# EAGLE design fanatone-adc (EAGLE 7.5.0)
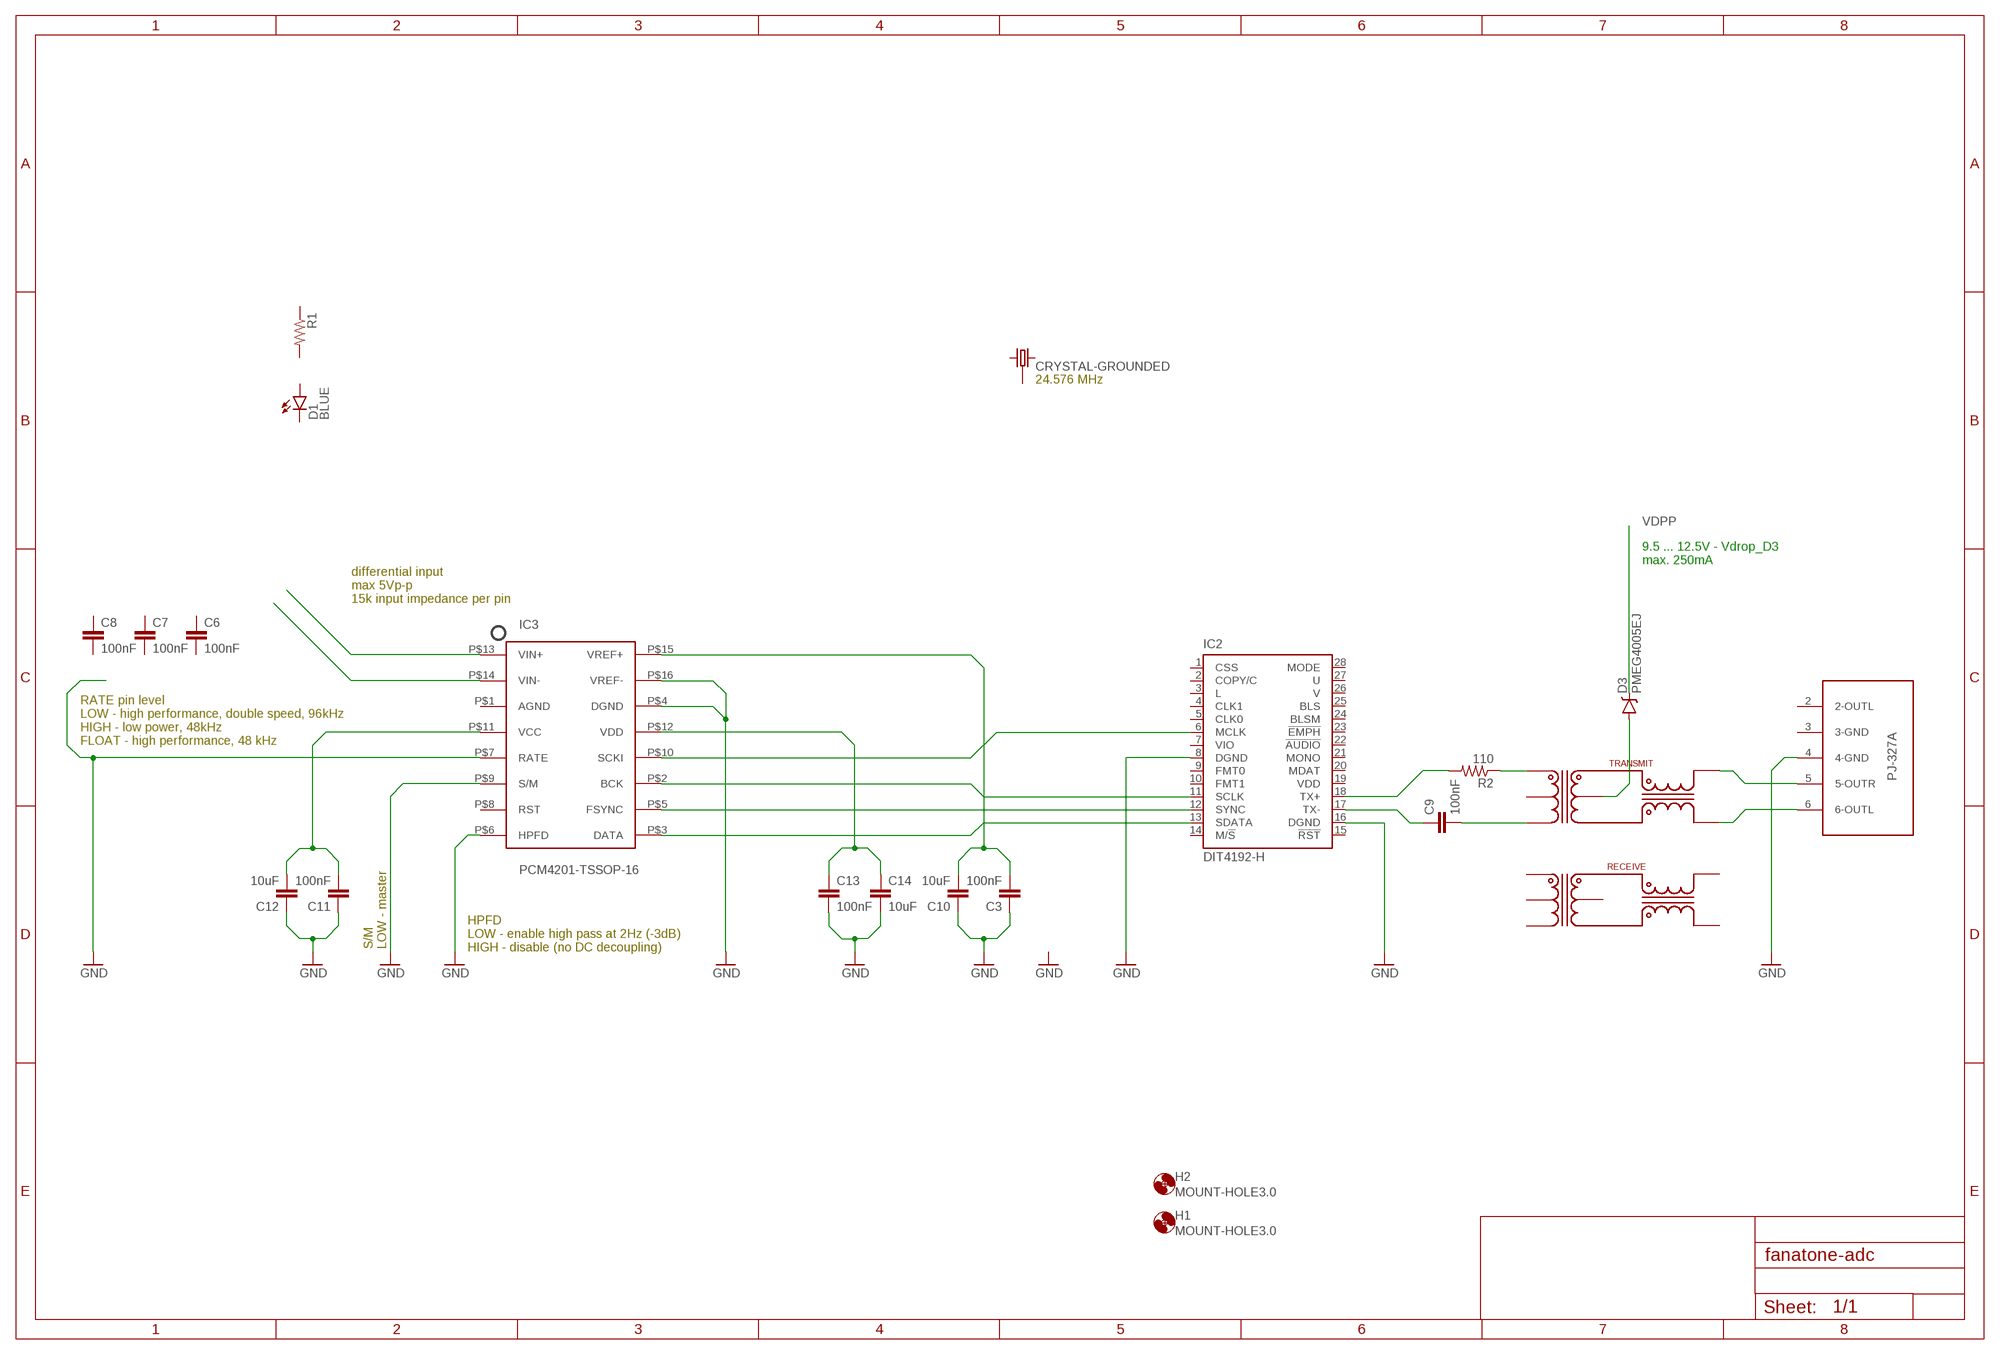
[diagram p0: schematic, sheet 1, part 1 of 3]
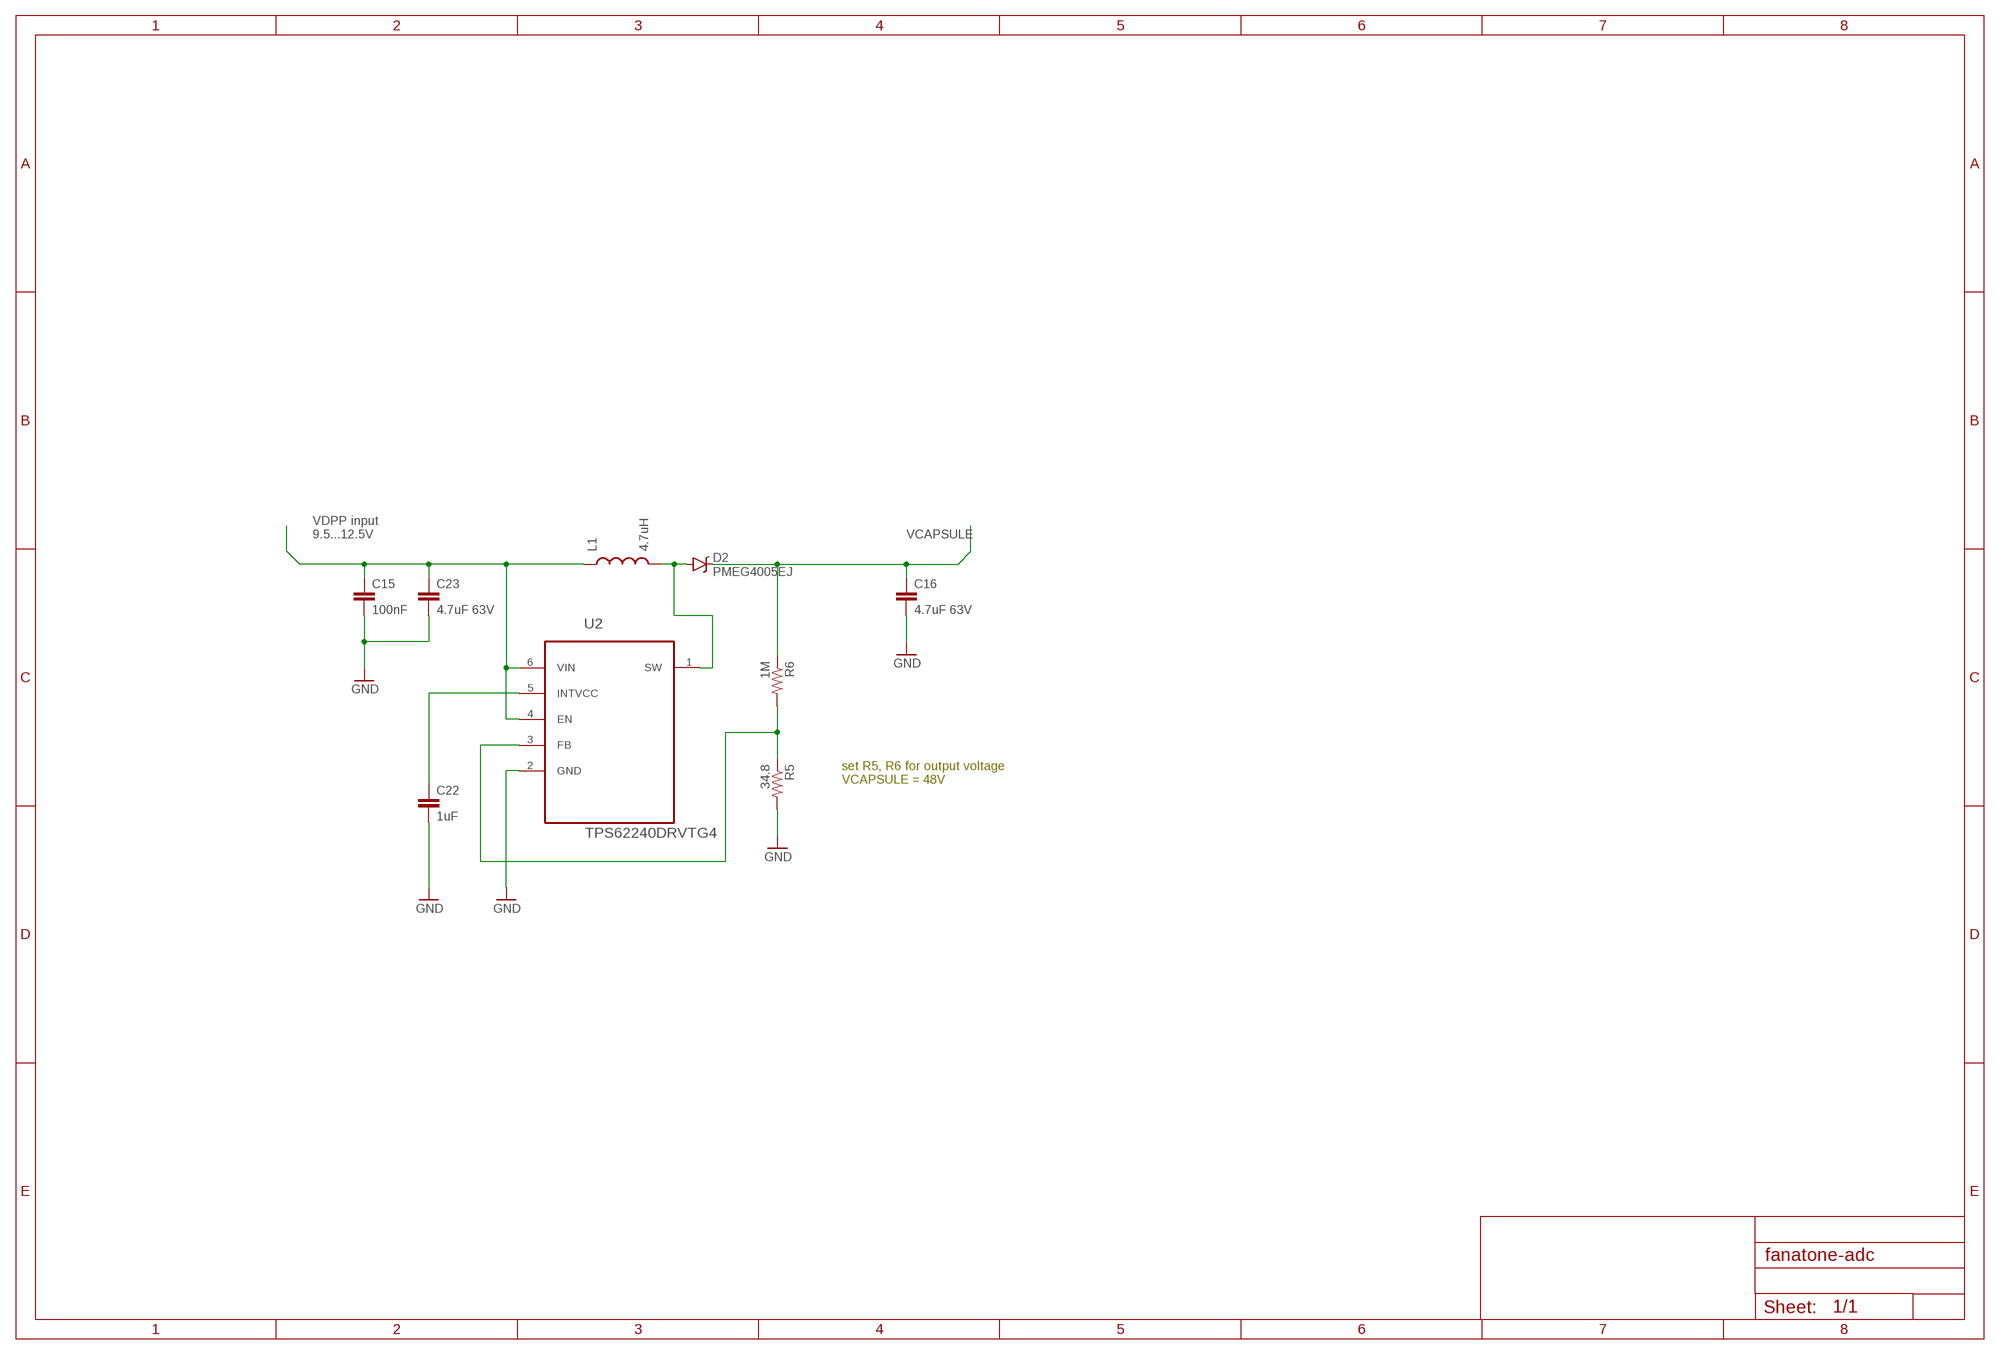
[diagram p1: schematic, sheet 1, part 2 of 3]
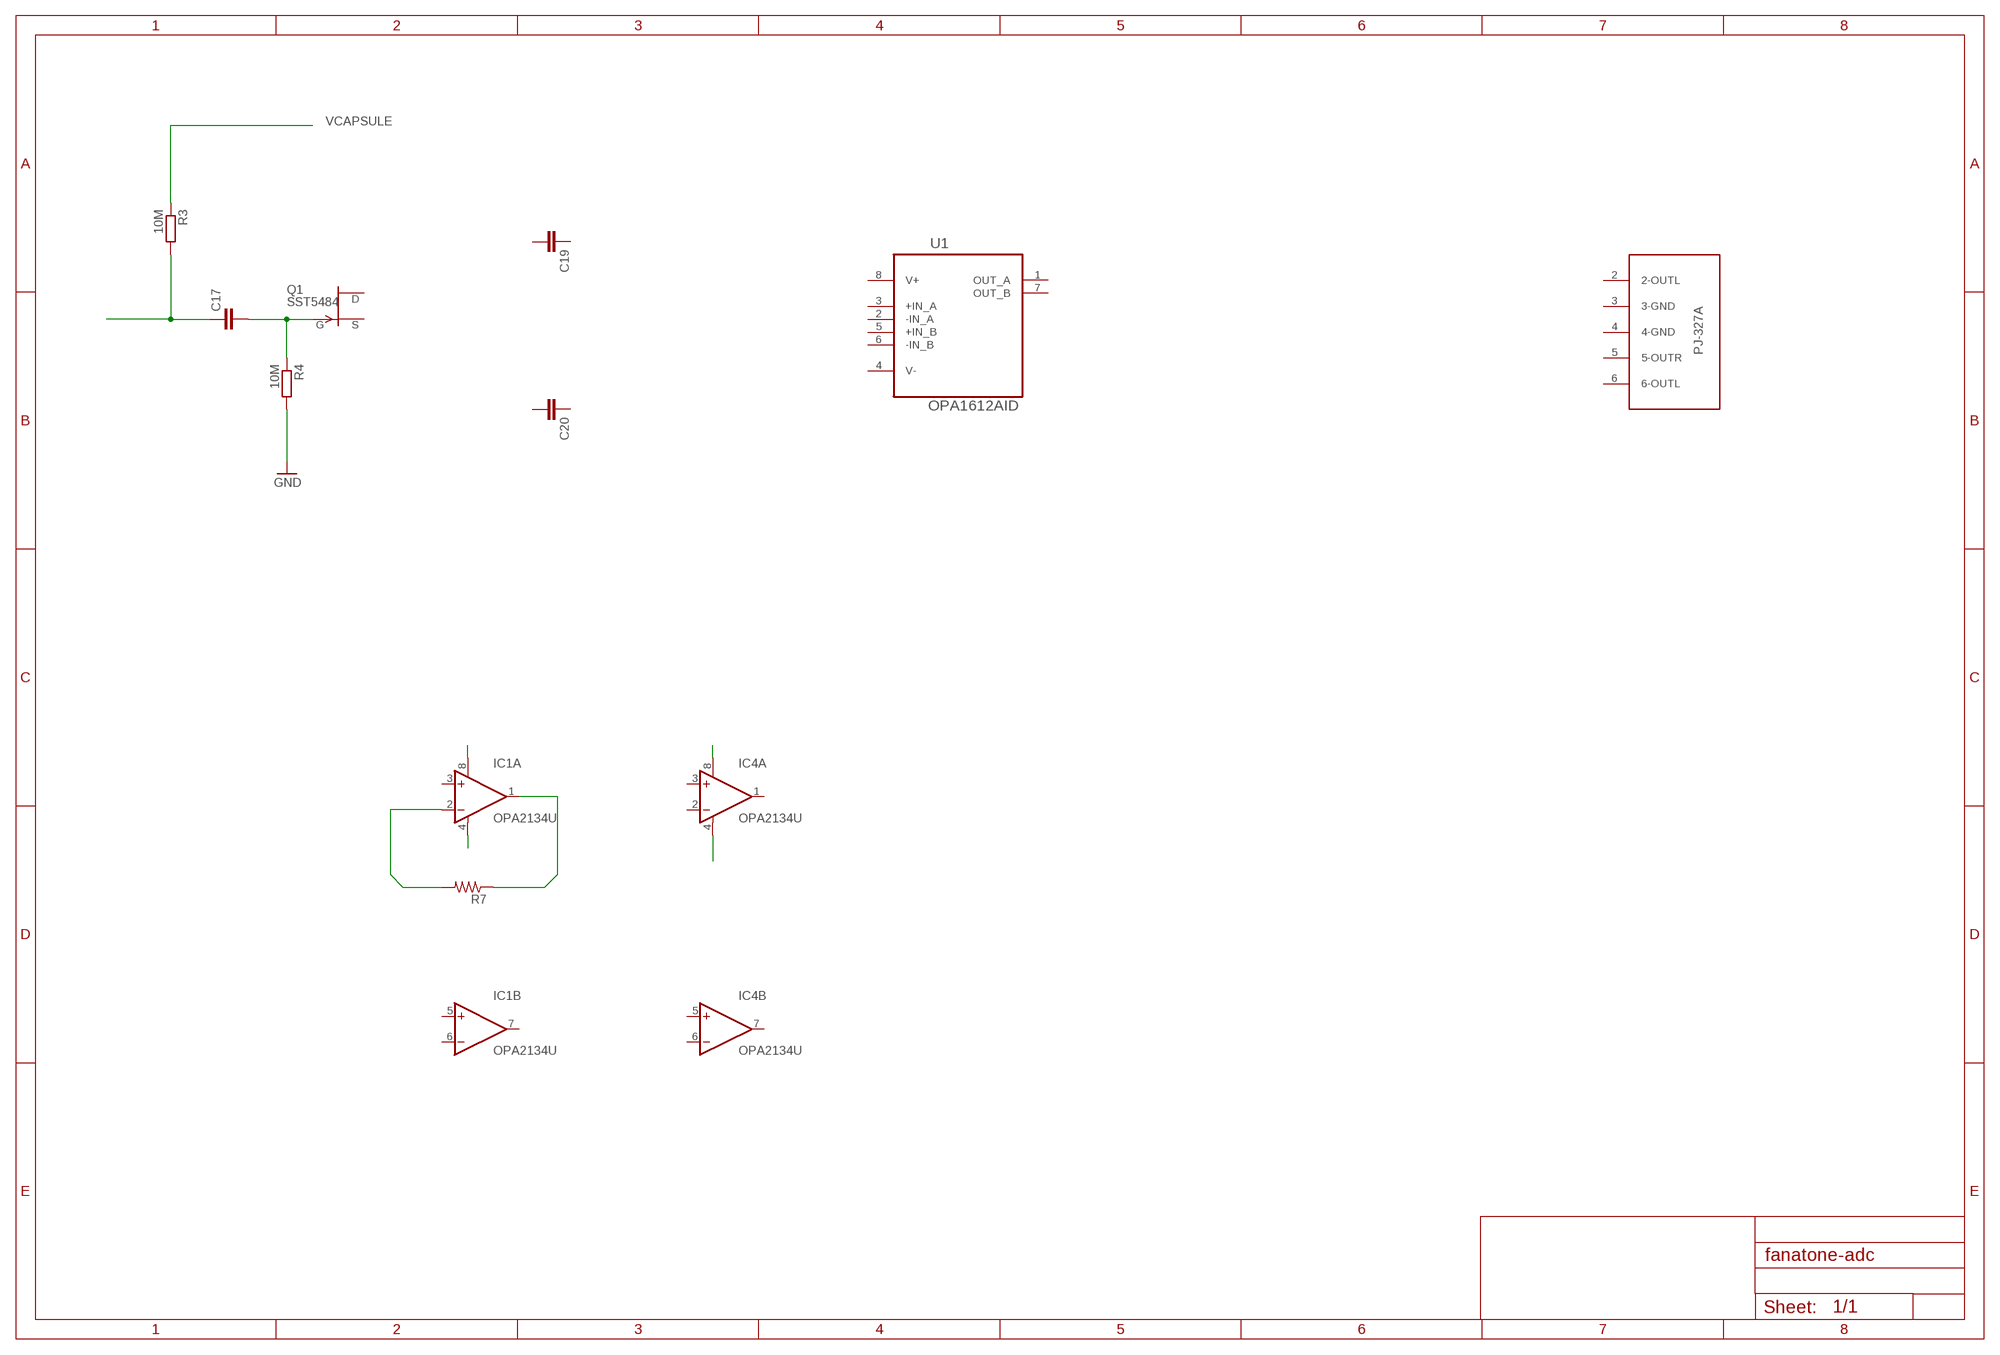
[diagram p2: schematic, sheet 1, part 3 of 3]

## Parts
C3  100nF  CAP0402-CAP  [0402-CAP]
C6  100nF  CAP0402-CAP  [0402-CAP]
C7  100nF  CAP0402-CAP  [0402-CAP]
C8  100nF  CAP0402-CAP  [0402-CAP]
C9  100nF  CAP0402-CAP  [0402-CAP]
C10  10uF  CAP0805  [0805]
C11  100nF  CAP0402-CAP  [0402-CAP]
C12  10uF  CAP0805  [0805]
C13  100nF  CAP0402-CAP  [0402-CAP]
C14  10uF  CAP0805  [0805]
C15  100nF  CAP0402-CAP  [0402-CAP]
C16  4.7uF 63V  CAP0805  [0805]
C17  C-EUC0603K  [C0603K]
C19  C-EUC0603K  [C0603K]
C20  C-EUC0603K  [C0603K]
C22  1uF  CAP0805  [0805]
C23  4.7uF 63V  CAP0805  [0805]
D1  BLUE  LED-BLUE0603  [LED-0603]
D2  PMEG4005EJ  DIODE-SCHOTTKY-PMEG4005EJ  [SOD-323]
D3  PMEG4005EJ  DIODE-SCHOTTKY-PMEG4005EJ  [SOD-323]
H1  MOUNT-HOLE3.0  [3,0]
H2  MOUNT-HOLE3.0  [3,0]
IC1  OPA2134U  [SO08]
IC2  DIT4192-H  [PW_R-PDSO-G28]
IC3  PCM4201-TSSOP-16  [TSSOP-16]
IC4  OPA2134U  [SO08]
L1  4.7uH  INDUCTOR0805  [0805]
Q1  SST5484  [SOT23]
R1  RESISTOR0603-RES  [0603-RES]
R2  110  RESISTOR0603-RES  [0603-RES]
R3  10M  R-EU_R0805W  [R0805W]
R4  10M  R-EU_R0805W  [R0805W]
R5  34.8  RESISTOR0603-RES  [0603-RES]
R6  1M  RESISTOR0603-RES  [0603-RES]
R7  RESISTOR0603-RES  [0603-RES]
U1  OPA1612AID  [SOIC127P600X175-8N]
U2  TPS62240DRVTG4  [SON65P210X210X80-7N]
U$1  CRYSTAL-GROUNDED  [CRYSTAL-SMD-5X3]
U$2  PJ-327A  [PJ-327A]
U$3  PJ-327A  [PJ-327A]
U$4  H1102  [H11XX]

## Nets
3V3: C13.1 C14.1 IC3.P$12(VDD)
5V: C11.2 C12.2 IC3.P$11(VCC)
GND: C3.1 C10.1 C11.1 C12.1 C13.2 C14.2 C15.2 C16.2 C22.2 C23.2 IC2.8(DGND) IC2.16(DGND) IC3.P$4(DGND) IC3.P$6(HPFD) IC3.P$7(RATE) IC3.P$9(S/M) IC3.P$16(VREF-) R4.2 R5.2 U2.2(GND) U$2.4(4-GND)
N$1: C9.2 U$4.3
N$2: R2.1 U$4.1
N$3: C17.1 R3.2
N$4: C17.2 Q1.3(G) R4.1
N$5: C3.2 C10.2 IC3.P$15(VREF+)
N$6: IC2.18(TX+) R2.2
N$7: R5.1 R6.2 U2.3(FB)
N$8: C22.1 U2.5(INTVCC)
N$9: C9.1 IC2.17(TX-)
N$10: D3.A U$4.15
N$11: D2.A L1.2 U2.1(SW)
N$12: IC2.11(SCLK) IC3.P$2(BCK)
N$14: IC2.12(SYNC) IC3.P$5(FSYNC)
N$15: IC2.13(SDATA) IC3.P$3(DATA)
N$16: U$2.6(6-OUTL) U$4.14
N$17: IC2.6(MCLK) IC3.P$10(SCKI)
N$18: U$2.5(5-OUTR) U$4.16
N$19: IC3.P$13(VIN+)
N$20: IC3.P$14(VIN-)
N$21: IC1.1(A:OUT) R7.1
N$22: IC1.2(A:-IN) R7.2
N$23: IC1.4(A:V-)
N$24: IC1.8(A:V+)
N$25: IC4.8(A:V+)
N$26: IC4.4(A:V-)
VCAPSULE: C16.1 D2.C R3.1 R6.1
VDPP: C15.1 C23.1 D3.C L1.1 U2.4(EN) U2.6(VIN)
Unconnected: C6.1 C6.2 C7.1 C7.2 C8.1 C8.2 C19.1 C19.2 C20.1 C20.2 D1.A D1.C IC1.3(A:+IN) IC1.5(B:+IN) IC1.6(B:-IN) IC1.7(B:OUT) IC2.1(CSS) IC2.2(COPY/C) IC2.3(L) IC2.4(CLK1) IC2.5(CLK0) IC2.9(FMT0) IC2.10(FMT1) IC2.14(M/!S) IC2.15(!RST) IC2.20(MDAT) IC2.21(MONO) IC2.22(!AUDIO) IC2.23(!EMPH) IC2.24(BLSM) IC2.25(BLS) IC2.26(V) IC2.27(U) IC2.28(MODE) IC3.P$1(AGND) IC3.P$8(RST) IC4.1(A:OUT) IC4.2(A:-IN) IC4.3(A:+IN) IC4.5(B:+IN) IC4.6(B:-IN) IC4.7(B:OUT) Q1.1(D) Q1.2(S) R1.1 R1.2 U1.1(OUT_A) U1.2(-IN_A) U1.3(+IN_A) U1.5(+IN_B) U1.6(-IN_B) U1.7(OUT_B) U$1.1 U$1.2 U$1.3 U$1.4 U$2.2(2-OUTL) U$2.3(3-GND) U$3.2(2-OUTL) U$3.3(3-GND) U$3.4(4-GND) U$3.5(5-OUTR) U$3.6(6-OUTL) U$4.2 U$4.6 U$4.7 U$4.8 U$4.9 U$4.10 U$4.11

## Notes on the sheet
- 24.576 MHz
- 9.5 ... 12.5V - Vdrop_D3
  max. 250mA
- differential input
  max 5Vp-p
  15k input impedance per pin
- RATE pin level
  LOW - high performance, double speed, 96kHz
  HIGH - low power, 48kHz
  FLOAT - high performance, 48 kHz
- S/M
  LOW - master
- HPFD
  LOW - enable high pass at 2Hz (-3dB)
  HIGH - disable (no DC decoupling)
- VDPP input
  9.5...12.5V
- set R5, R6 for output voltage
  VCAPSULE = 48V

## Power pins joined to a net without a drawn wire
V+: U1.8(V+)
V-: U1.4(V-)
VDD: IC2.19(VDD)
VIO: IC2.7(VIO)

## Library data of the parts
C3 C6-C16 C22 C23 = SparkFun-Passives:CAP: Capacitor Standard 0603 ceramic capacitor, and 0.1" leaded capacitor.
C17 C19 C20 = rcl:C-EU: CAPACITOR, European symbol
D1 = SparkFun-LED:LED-BLUE: Blue LEDs for production use Various blue LEDs stocked by SparkFun production 0603 - DIO-08575 Rebel - DIO-09553 1206 - DIO-09911; PROD_ID: DIO-08575
D2 D3 = SparkFun-DiscreteSemi:DIODE-SCHOTTKY: Schottky diodes in SFE's production catalog BAT20J 1A 23V 0.62Vf RB751 120mA 40V 0.37Vf PMEG4005EJ 0.5A 40V 0.42Vf MBRA140 1A 40V 0.5Vf B340A 3A 40V SMA; PROD_ID: DIO-10955
H1 H2 = holes:MOUNT-HOLE: MOUNTING HOLE with drill center marker
IC1 IC4 = burr-brown:OPA2134: Operational Amplifier; MF: TEXAS INSTRUMENTS; MPN: OPA2134UA; OC_FARNELL: 1206935; OC_NEWARK: 35C1847
IC2 = texas:DIT4192-H: 192kHz Digital Audio Transmitter Hardware Mode Source: http://focus.ti.com/lit/ds/symlink/dit4192.pdf; MF: TEXAS INSTRUMENTS; MPN: DIT4192IPW; OC_FARNELL: 7455057; OC_NEWARK: 74C9511
IC3 = TI-PCM4201:PCM4201
L1 = SparkFun-Passives:INDUCTOR: Inductors Basic Inductor/Choke - 0603 and 1206. Footprints are not proven and vary greatly between part numbers. SRN6045- 33uH, 20% 1.4A SDR0403-560KL - 56uH, 10%, 500mA RMS/740mA peak
Q1 = transistor-fet:?548*: N-Channel JFETs Source: VISHAY 2N5484.pdf Compatible: TO92 2N5245 J304 J305 U310 J308 J309 J310 TO72 2N4416 2N4416A 2N3823 2N4351 3N169 3N170 3N171 MFE3002 TO18 2N3796 2N3797 MFE825 Source: Motorola European Master Guide Pacge 3-59
R1 R2 R5-R7 = SparkFun-Passives:RESISTOR: Resistor Basic schematic elements and footprints for 0603, 1206, and PTH resistors.
R3 R4 = rcl:R-EU_: RESISTOR, European symbol
U1 = LT8330-boost-TSOT23:OPA1612AID: AUDIO OPERATIONAL AMPLIFIERS; MPN: OPA1612AID; OC_FARNELL: 1754265; OC_NEWARK: 25R6133; PACKAGE: SOIC-8; SUPPLIER: TI
U2 = LT8330-boost-TSOT23:TPS62240DRVTG4: 2.25 MHz 300 mA Step Down Converter in 2x2SON/TSOT23 Package; MPN: LT8330; PACKAGE: SON-6; SUPPLIER: Linear Technology
U$1 = SparkFun-FreqCtrl:CRYSTAL-GROUNDED
U$2 U$3 = PJ327A-TRS:PJ-327A
U$4 = trafo-pulse:H1102: PULSE SMT Ethernet transformer RX 1:1, TX 1:1, Central Tap

## Board
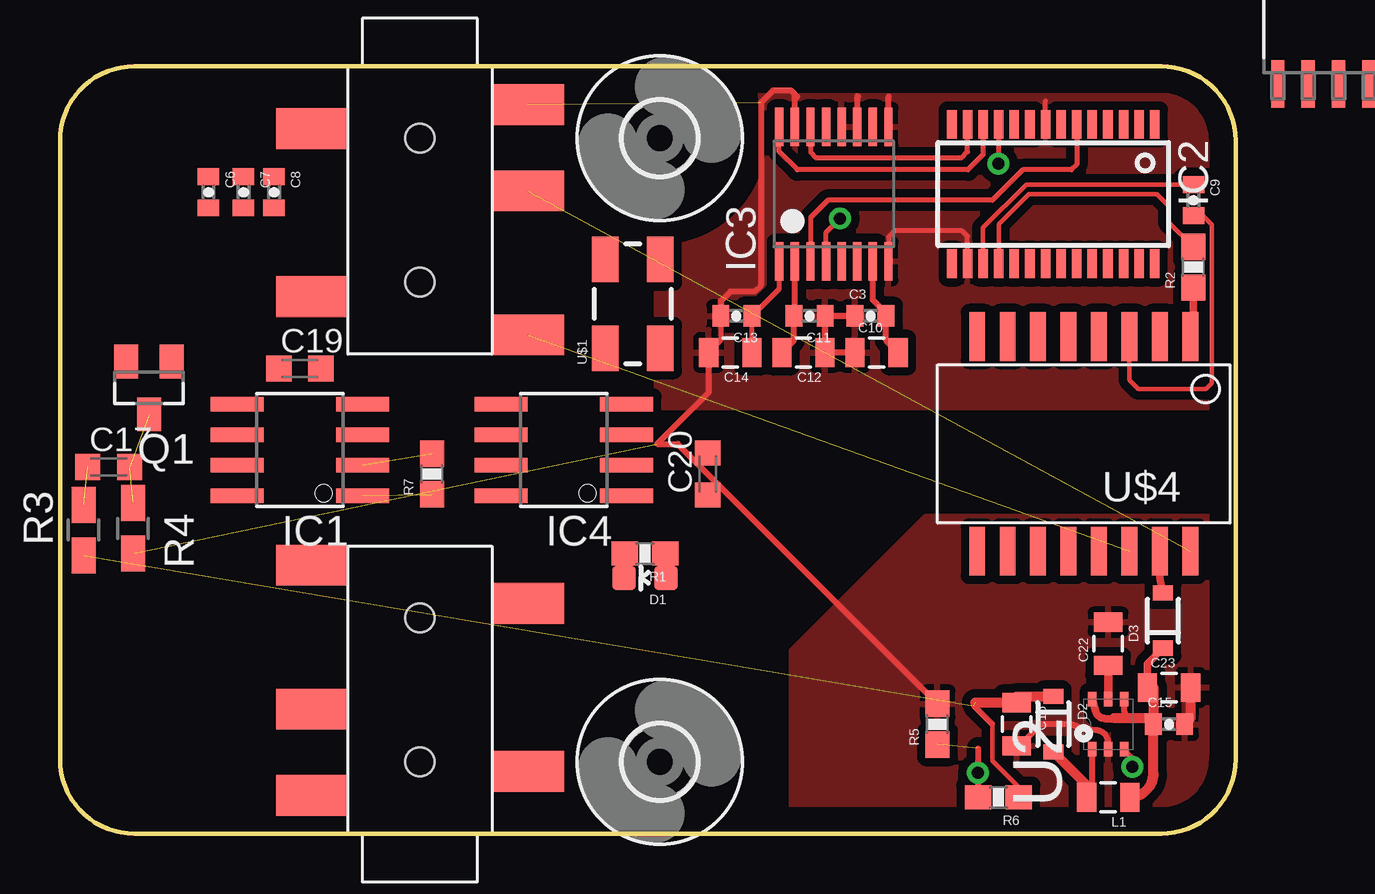
[diagram p3: board, top side]
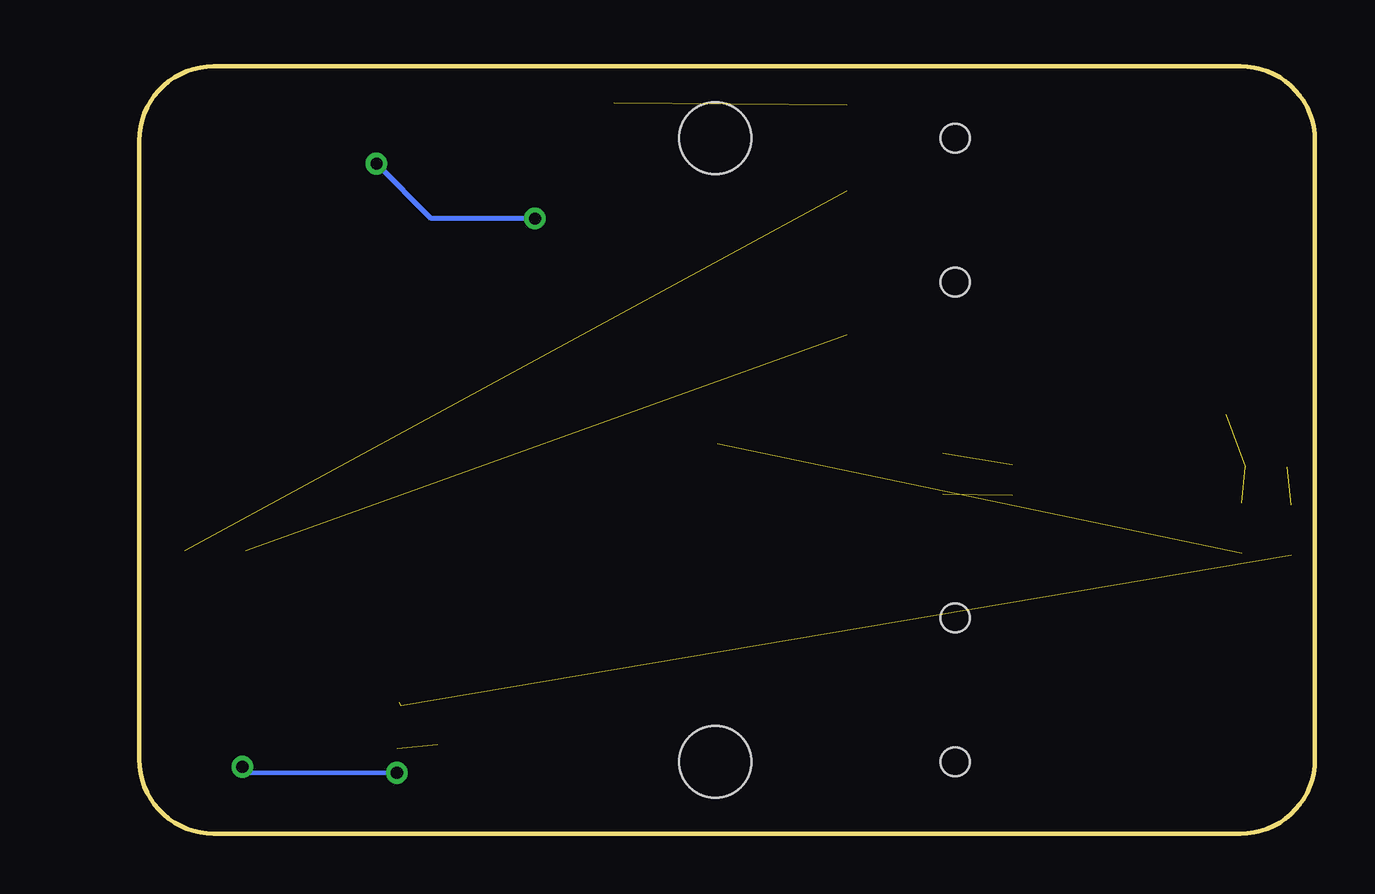
[diagram p4: board, bottom side, seen from below]

Size 49 x 32 mm. Coordinates in mm from the lower left corner, seen from the top.
Outline: 0,3.1 0,28.9 arc-90 3.1,32 45.9,32 arc-90 49,28.9 49,3.1 arc-90 45.9,0 3.1,0 arc-90 0,3.1
Copper layers (1*16): Top 0.035mm / dielectric 1.5mm / Bottom 0.035mm
Design rules "default": minimum track width 10mil, minimum drill 24mil, track to track 8mil, track to pad 8mil, pad to pad 8mil, via to via 8mil, smd to smd 8mil, copper to edge 40mil, drill to drill 8mil, minimum pad ring 10mil, minimum via ring 8mil, stop-mask expansion 4mil, vias tented up to drill 0mil, thermal gap 10mil

### Footprints (pad centres in the part's own frame; a part is rotated, then mirrored left to right if it is on the bottom)
0402-CAP = smd 0.7 x 0.9: 1 -0.65,0; 2 0.65,0
0805 = smd 0.8 x 1.2: 1 -0.9,0; 2 0.9,0
C0603K = smd 1.05 x 1.08: 1 -0.875,0; 2 0.875,0
LED-0603 = smd 1 x 1: A 0,-0.877; C 0,0.877
SOD-323 = smd 0.63 x 0.83: A 1.15,0; C -1.15,0
3,0 = hole 3: 0,0
SO08 = smd 0.61 x 2.21: 1 -1.905,-2.616; 2 -0.635,-2.616; 3 0.635,-2.616; 4 1.905,-2.616; 5 1.905,2.616; 6 0.635,2.616; 7 -0.635,2.616; 8 -1.905,2.616
PW_R-PDSO-G28 = smd 0.4 x 1.2: 1 -4.225,-2.9; 2 -3.575,-2.9; 3 -2.925,-2.9; 4 -2.275,-2.9; 5 -1.625,-2.9; 6 -0.975,-2.9; 7 -0.325,-2.9; 8 0.325,-2.9; 9 0.975,-2.9; 10 1.625,-2.9; 11 2.275,-2.9; 12 2.925,-2.9; 13 3.575,-2.9; 14 4.225,-2.9; 15 4.225,2.9; 16 3.575,2.9; 17 2.925,2.9; 18 2.275,2.9; 19 1.625,2.9; 20 0.975,2.9; 21 0.325,2.9; 22 -0.325,2.9; 23 -0.975,2.9; 24 -1.625,2.9; 25 -2.275,2.9; 26 -2.925,2.9; 27 -3.575,2.9; 28 -4.225,2.9
TSSOP-16 = smd 0.35 x 1.6: P$1 -0.325,2.8; P$2 -0.325,-2.8; P$3 -0.975,2.8; P$4 -1.625,2.8; P$5 -2.275,2.8; P$6 0.325,2.8; P$7 0.975,2.8; P$8 1.625,2.8; P$9 2.275,2.8; P$10 -0.975,-2.8; P$11 -1.625,-2.8; P$12 -2.275,-2.8; P$13 0.325,-2.8; P$14 0.975,-2.8; P$15 1.625,-2.8; P$16 2.275,-2.8
SOT23 = smd 1 x 1.4: 1 -0.95,-1.1; 2 0.95,-1.1; 3 0,1.1
0603-RES = smd 1.1 x 1: 1 -0.85,0; 2 0.85,0
R0805W = smd 1.5 x 1: 1 -1.052,0; 2 1.052,0
SOIC127P600X175-8N = smd 1.981 x 0.559: 1 -2.464,1.905; 2 -2.464,0.635; 3 -2.464,-0.635; 4 -2.464,-1.905; 5 2.464,-1.905; 6 2.464,-0.635; 7 2.464,0.635; 8 2.464,1.905
SON65P210X210X80-7N = smd 0.61 x 0.356: 1 -1.041,0.66; 2 -1.041,0; 3 -1.041,-0.66; 4 1.041,-0.66; 5 1.041,0; 6 1.041,0.66 | smd 0.003 x 0.003: 7 0,0
CRYSTAL-SMD-5X3 = smd 1.9 x 1.1: 1 -1.85,-1.15; 2 1.85,-1.15; 3 1.85,1.15; 4 -1.85,1.15
PJ-327A = smd 1.7 x 3: 2 9.6,-4.5; 3 2.6,-4.5; 4 1.6,4.5; 5 5.2,4.5; 6 11.2,4.5 | hole 1.2: 3,0; 9,0
H11XX = smd 0.66 x 2.032: 1 -4.445,-4.47; 2 -3.175,-4.47; 3 -1.905,-4.47; 4 -0.635,-4.47; 5 0.635,-4.47; 6 1.905,-4.47; 7 3.175,-4.47; 8 4.445,-4.47; 9 4.445,4.47; 10 3.175,4.47; 11 1.905,4.47; 12 0.635,4.47; 13 -0.635,4.47; 14 -1.905,4.47; 15 -3.175,4.47; 16 -4.445,4.47

### Placement (x,y rotation side)
C3  33.78,21.59 0 top
C6  6.19,26.75 270 top
C7  7.65,26.75 270 top
C8  8.92,26.75 270 top
C9  47.24,26.42 270 top
C10  34.04,20.07 0 top
C11  31.24,21.59 180 top
C12  30.99,20.07 180 top
C13  28.19,21.59 180 top
C14  27.94,20.07 180 top
C15  46.23,4.57 0 top
C16  39.88,4.57 270 top
C17  2.03,15.29 0 top
C19  10,19.4 0 top
C20  27,15 90 top
C22  43.69,7.92 90 top
C23  46.23,6.1 0 top
D1  24.38,10.67 90 top
D2  41.4,4.57 270 top
D3  45.97,8.89 90 top
H1  25,3 0 top
H2  25,29 0 top
IC1  10,16 90 top
IC2  41.4,26.67 180 top
IC3  32.26,26.67 0 top
IC4  21,16 90 top
L1  43.69,1.52 180 top
Q1  3.71,18.59 180 top
R1  24.38,11.68 180 top
R2  47.24,23.62 90 top
R3  0.98,12.66 90 top
R4  3.05,12.73 270 top
R5  36.58,4.57 90 top
R6  39.12,1.52 180 top
R7  15.5,15 90 top
U1  52.66,33.73 270 top
U2  43.69,4.57 90 top
U$1  23.88,22.1 90 top
U$2  15,32 270 top
U$3  15,0 90 top
U$4  42.67,16.26 180 top

### Tracks (layer width: path | path; a pad name or v marks a point on that pad's centre or on a via)
3V3
  Top 0.203: C14.1 C13.1 29.98,22.73 IC3.P$12
5V
  Top 0.254: IC3.P$11 30.63,21.63 C11.2 30.59,20.57 C12.2
GND  (2 unrouted)
  Top 0.203: IC2.8 41.08,30.55 | IC3.P$7 33.23,30.77 | IC2.16 37.83,24.91 37.59,25.15 34.8,25.15 34.54,24.89 34.54,23.88 IC3.P$16 | C13.2 27.54,20.57 C14.2
  Top 0.254: C16.2 39.99,3.67 40.89,4.57 42.16,4.57 arc28 43.18,4.32 arc-90 43.69,3.81 U2.2 | C3.1 C11.1 C12.1 C10.1 | C14.2 27.04,18.4 24.89,16.26 25.74,16.26 R5.2 | IC3.P$4 30.63,30.63 | 30.63,30.63 30.73,30.73 | IC3.P$7 33.23,30.69 33.27,30.73 | IC3.P$9 34.53,30.72 34.54,30.73 | 30.63,30.63 30.63,30.84 30.48,30.99 29.72,30.99 29.21,30.48 29.21,22.86 28.96,22.61 27.94,22.61 27.54,22.21 C13.2
  Top 0.406: C15.2 47.13,4.82 C23.2
  pour Top (isolate 0.356): 30.48,0 48.77,0 48.77,13.21 36.07,13.21 30.48,7.62
  pour Top (isolate 0.356): 48.77,32 48.77,17.78 24.89,17.78 24.89,32
N$1
  Top 0.178: U$4.3 44.58,18.92 44.96,18.54 47.75,18.54 48.01,18.8 48.01,25.4 47.64,25.77 C9.2
N$2
  Top 0.305: R2.1 47.24,20.85 U$4.1
N$3  (1 unrouted)
N$4  (2 unrouted)
N$5
  Top 0.254: IC3.P$15 33.88,22.25 34.43,21.7 C3.2 34.43,20.57 C10.2
N$6
  Top 0.178: IC2.18 39.13,25.41 40.39,26.67 45.72,26.67 46.23,26.16 46.23,25.49 R2.2
N$7  (via drill 0.51)  (1 unrouted)
  Top 0.178: U2.3 44.7,3.17 v44.7,2.79
  Top 0.254: 44.35,3.71 U2.3 | 38.27,3.56 v38.27,2.54 R6.2
  Bottom 0.178: v44.7,2.79 44.45,2.54 v38.27,2.54
N$8
  Top 0.356: C22.1 U2.5
N$9
  Top 0.178: C9.1 40.27,27.07 38.48,25.27 IC2.17
N$10
  Top 0.305: U$4.15 45.85,10.68 D3.A
N$11
  Top 0.254: U2.1 43.03,1.76 L1.2 42.79,2.04
  Top 0.406: D2.A 42.79,2.04
N$12  (via drill 0.5)
  Top 0.203: IC3.P$2 31.93,25.07 v32.51,25.65 | v39.12,27.94 39.13,28.46 IC2.11
  Bottom 0.203: v32.51,25.65 36.83,25.65 v39.12,27.94
N$14
  Top 0.203: IC2.12 38.48,28.32 37.85,27.69 30.73,27.69 29.97,28.45 29.97,29.46 IC3.P$5
N$15
  Top 0.203: IC3.P$3 31.28,28.41 31.5,28.19 37.59,28.19 37.83,28.43 IC2.13
N$16  (1 unrouted)
N$17
  Top 0.203: IC2.6 42.38,27.9 42.16,27.69 40.13,27.69 38.86,26.42 32,26.42 31.28,25.7 IC3.P$10
N$18  (1 unrouted)
N$21  (1 unrouted)
N$22  (1 unrouted)
VCAPSULE  (2 unrouted)
  Top 0.178: 38.86,4.57 38.86,3.05 39.97,1.94 R6.1
  Top 0.254: C16.1 39.87,5.72 | 38.1,5.33 38.86,4.57
  Top 0.406: 39.87,5.72 D2.C | 38.15,5.47 C16.1
VDPP
  Top 0.254: C23.1 45.58,6.1 | U2.4 44.35,5.18 arc90 44.7,4.83
  Top 0.305: U2.6 43.18,5.08 arc58 43.43,4.83 arc32 43.94,4.83 | D3.C 45.33,7.09 C23.1
  Top 0.406: 45.58,6.1 C15.1 | 43.94,4.83 44.7,4.83 45.58,4.83 C15.1 | L1.1 arc90 45.58,2.51 C15.1